# EAGLE design Main (EAGLE 9.1.3)

## Sheet 1 of 3
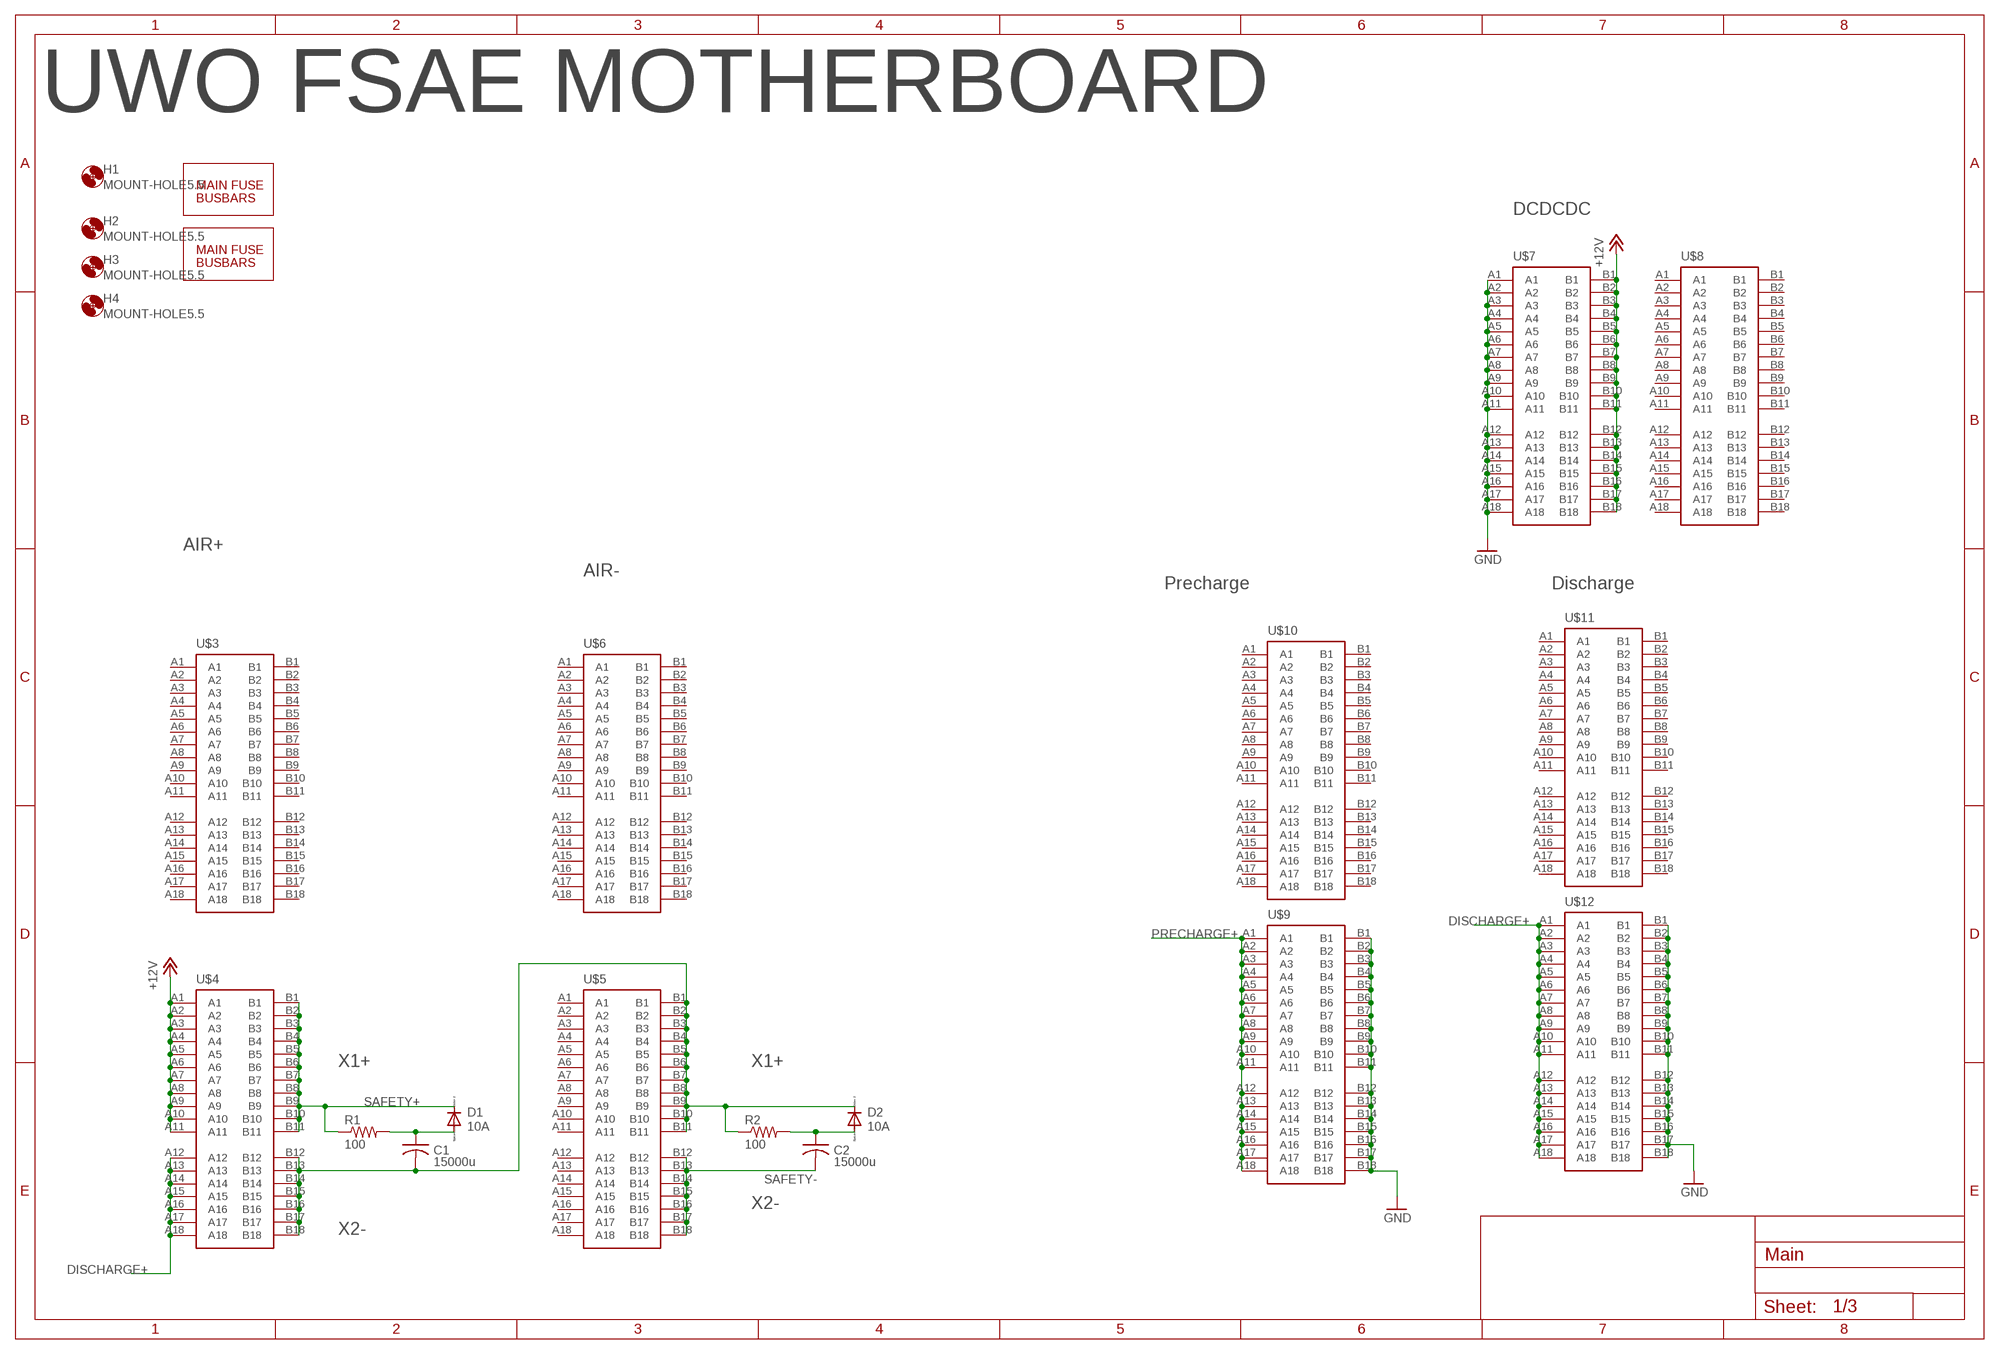
[diagram p0: schematic, sheet 1]

### Parts
C1  15000u  AIR_HOLDUP_CAP  [CAPPRD750W65D1800H3700B]
C2  15000u  AIR_HOLDUP_CAP  [CAPPRD750W65D1800H3700B]
D1  10A  AIR_HOLDUP_DIODE  [DIOAD1570W120L850D500B]
D2  10A  AIR_HOLDUP_DIODE  [DIOAD1570W120L850D500B]
H1  MOUNT-HOLE5.5  [5,5]
H2  MOUNT-HOLE5.5  [5,5]
H3  MOUNT-HOLE5.5  [5,5]
H4  MOUNT-HOLE5.5  [5,5]
R1  100  AIR_HOLDUP_RESISTOR  [RESAD976W63L650D250B]
R2  100  AIR_HOLDUP_RESISTOR  [RESAD976W63L650D250B]
U$1  FUSE_HOLDER  [FUSE_HOLDER]
U$2  FUSE_HOLDER  [FUSE_HOLDER]
U$3  PCIE-36-CONN  [PCI-E-36-CONN]
U$4  PCIE-36-CONN  [PCI-E-36-CONN]
U$5  PCIE-36-CONN  [PCI-E-36-CONN]
U$6  PCIE-36-CONN  [PCI-E-36-CONN]
U$7  PCIE-36-CONN  [PCI-E-36-CONN]
U$8  PCIE-36-CONN  [PCI-E-36-CONN]
U$9  PCIE-36-CONN  [PCI-E-36-CONN]
U$10  PCIE-36-CONN  [PCI-E-36-CONN]
U$11  PCIE-36-CONN  [PCI-E-36-CONN]
U$12  PCIE-36-CONN  [PCI-E-36-CONN]

### Nets
+12V: U$4.A1 U$4.A2 U$4.A3 U$4.A4 U$4.A5 U$4.A6 U$4.A7 U$4.A8 U$4.A9 U$4.A10 U$4.A11 U$7.B1 U$7.B2 U$7.B3 U$7.B4 U$7.B5 U$7.B6 U$7.B7 U$7.B8 U$7.B9 U$7.B10 U$7.B11 U$7.B12 U$7.B13 U$7.B14 U$7.B15 U$7.B16 U$7.B17 U$7.B18 ; also sheet 2,3
DISCHARGE+: U$4.A12 U$4.A13 U$4.A14 U$4.A15 U$4.A16 U$4.A17 U$4.A18 U$12.A1 U$12.A2 U$12.A3 U$12.A4 U$12.A5 U$12.A6 U$12.A7 U$12.A8 U$12.A9 U$12.A10 U$12.A11 U$12.A12 U$12.A13 U$12.A14 U$12.A15 U$12.A16 U$12.A17 U$12.A18
GND: U$7.A1 U$7.A2 U$7.A3 U$7.A4 U$7.A5 U$7.A6 U$7.A7 U$7.A8 U$7.A9 U$7.A10 U$7.A11 U$7.A12 U$7.A13 U$7.A14 U$7.A15 U$7.A16 U$7.A17 U$7.A18 U$9.B1 U$9.B2 U$9.B3 U$9.B4 U$9.B5 U$9.B6 U$9.B7 U$9.B8 U$9.B9 U$9.B10 U$9.B11 U$9.B12 U$9.B13 U$9.B14 U$9.B15 U$9.B16 U$9.B17 U$9.B18 U$12.B1 U$12.B2 U$12.B3 U$12.B4 U$12.B5 U$12.B6 U$12.B7 U$12.B8 U$12.B9 U$12.B10 U$12.B11 U$12.B12 U$12.B13 U$12.B14 U$12.B15 U$12.B16 U$12.B17 U$12.B18 ; also sheet 2,3
N$3: C1.1 D1.2(A) R1.2
N$4: C1.2 D2.1(C) R2.1 U$4.B12 U$4.B13 U$4.B14 U$4.B15 U$4.B16 U$4.B17 U$4.B18 U$5.B1 U$5.B2 U$5.B3 U$5.B4 U$5.B5 U$5.B6 U$5.B7 U$5.B8 U$5.B9 U$5.B10 U$5.B11
N$6: C2.1 D2.2(A) R2.2
PRECHARGE+: U$9.A1 U$9.A2 U$9.A3 U$9.A4 U$9.A5 U$9.A6 U$9.A7 U$9.A8 U$9.A9 U$9.A10 U$9.A11 U$9.A12 U$9.A13 U$9.A14 U$9.A15 U$9.A16 U$9.A17 U$9.A18 ; also sheet 2
SAFETY+: D1.1(C) R1.1 U$4.B1 U$4.B2 U$4.B3 U$4.B4 U$4.B5 U$4.B6 U$4.B7 U$4.B8 U$4.B9 U$4.B10 U$4.B11 ; also sheet 2
SAFETY-: C2.2 U$5.B12 U$5.B13 U$5.B14 U$5.B15 U$5.B16 U$5.B17 U$5.B18 ; also sheet 2
Unconnected: U$3.A1 U$3.A2 U$3.A3 U$3.A4 U$3.A5 U$3.A6 U$3.A7 U$3.A8 U$3.A9 U$3.A10 U$3.A11 U$3.A12 U$3.A13 U$3.A14 U$3.A15 U$3.A16 U$3.A17 U$3.A18 U$3.B1 U$3.B2 U$3.B3 U$3.B4 U$3.B5 U$3.B6 U$3.B7 U$3.B8 U$3.B9 U$3.B10 U$3.B11 U$3.B12 U$3.B13 U$3.B14 U$3.B15 U$3.B16 U$3.B17 U$3.B18 U$5.A1 U$5.A2 U$5.A3 U$5.A4 U$5.A5 U$5.A6 U$5.A7 U$5.A8 U$5.A9 U$5.A10 U$5.A11 U$5.A12 U$5.A13 U$5.A14 U$5.A15 U$5.A16 U$5.A17 U$5.A18 U$6.A1 U$6.A2 U$6.A3 U$6.A4 U$6.A5 U$6.A6 U$6.A7 U$6.A8 U$6.A9 U$6.A10 U$6.A11 U$6.A12 U$6.A13 U$6.A14 U$6.A15 U$6.A16 U$6.A17 U$6.A18 U$6.B1 U$6.B2 U$6.B3 U$6.B4 U$6.B5 U$6.B6 U$6.B7 U$6.B8 U$6.B9 U$6.B10 U$6.B11 U$6.B12 U$6.B13 U$6.B14 U$6.B15 U$6.B16 U$6.B17 U$6.B18 U$8.A1 U$8.A2 U$8.A3 U$8.A4 U$8.A5 U$8.A6 U$8.A7 U$8.A8 U$8.A9 U$8.A10 U$8.A11 U$8.A12 U$8.A13 U$8.A14 U$8.A15 U$8.A16 U$8.A17 U$8.A18 U$8.B1 U$8.B2 U$8.B3 U$8.B4 U$8.B5 U$8.B6 U$8.B7 U$8.B8 U$8.B9 U$8.B10 U$8.B11 U$8.B12 U$8.B13 U$8.B14 U$8.B15 U$8.B16 U$8.B17 U$8.B18 U$10.A1 U$10.A2 U$10.A3 U$10.A4 U$10.A5 U$10.A6 U$10.A7 U$10.A8 U$10.A9 U$10.A10 U$10.A11 U$10.A12 U$10.A13 U$10.A14 U$10.A15 U$10.A16 U$10.A17 U$10.A18 U$10.B1 U$10.B2 U$10.B3 U$10.B4 U$10.B5 U$10.B6 U$10.B7 U$10.B8 U$10.B9 U$10.B10 U$10.B11 U$10.B12 U$10.B13 U$10.B14 U$10.B15 U$10.B16 U$10.B17 U$10.B18 U$11.A1 U$11.A2 U$11.A3 U$11.A4 U$11.A5 U$11.A6 U$11.A7 U$11.A8 U$11.A9 U$11.A10 U$11.A11 U$11.A12 U$11.A13 U$11.A14 U$11.A15 U$11.A16 U$11.A17 U$11.A18 U$11.B1 U$11.B2 U$11.B3 U$11.B4 U$11.B5 U$11.B6 U$11.B7 U$11.B8 U$11.B9 U$11.B10 U$11.B11 U$11.B12 U$11.B13 U$11.B14 U$11.B15 U$11.B16 U$11.B17 U$11.B18

### Notes on the sheet
- UWO FSAE MOTHERBOARD
- DCDCDC
- AIR+
- AIR-
- Precharge | Discharge
- X1+ | X1+
- X2-
- X2-

## Sheet 2 of 3
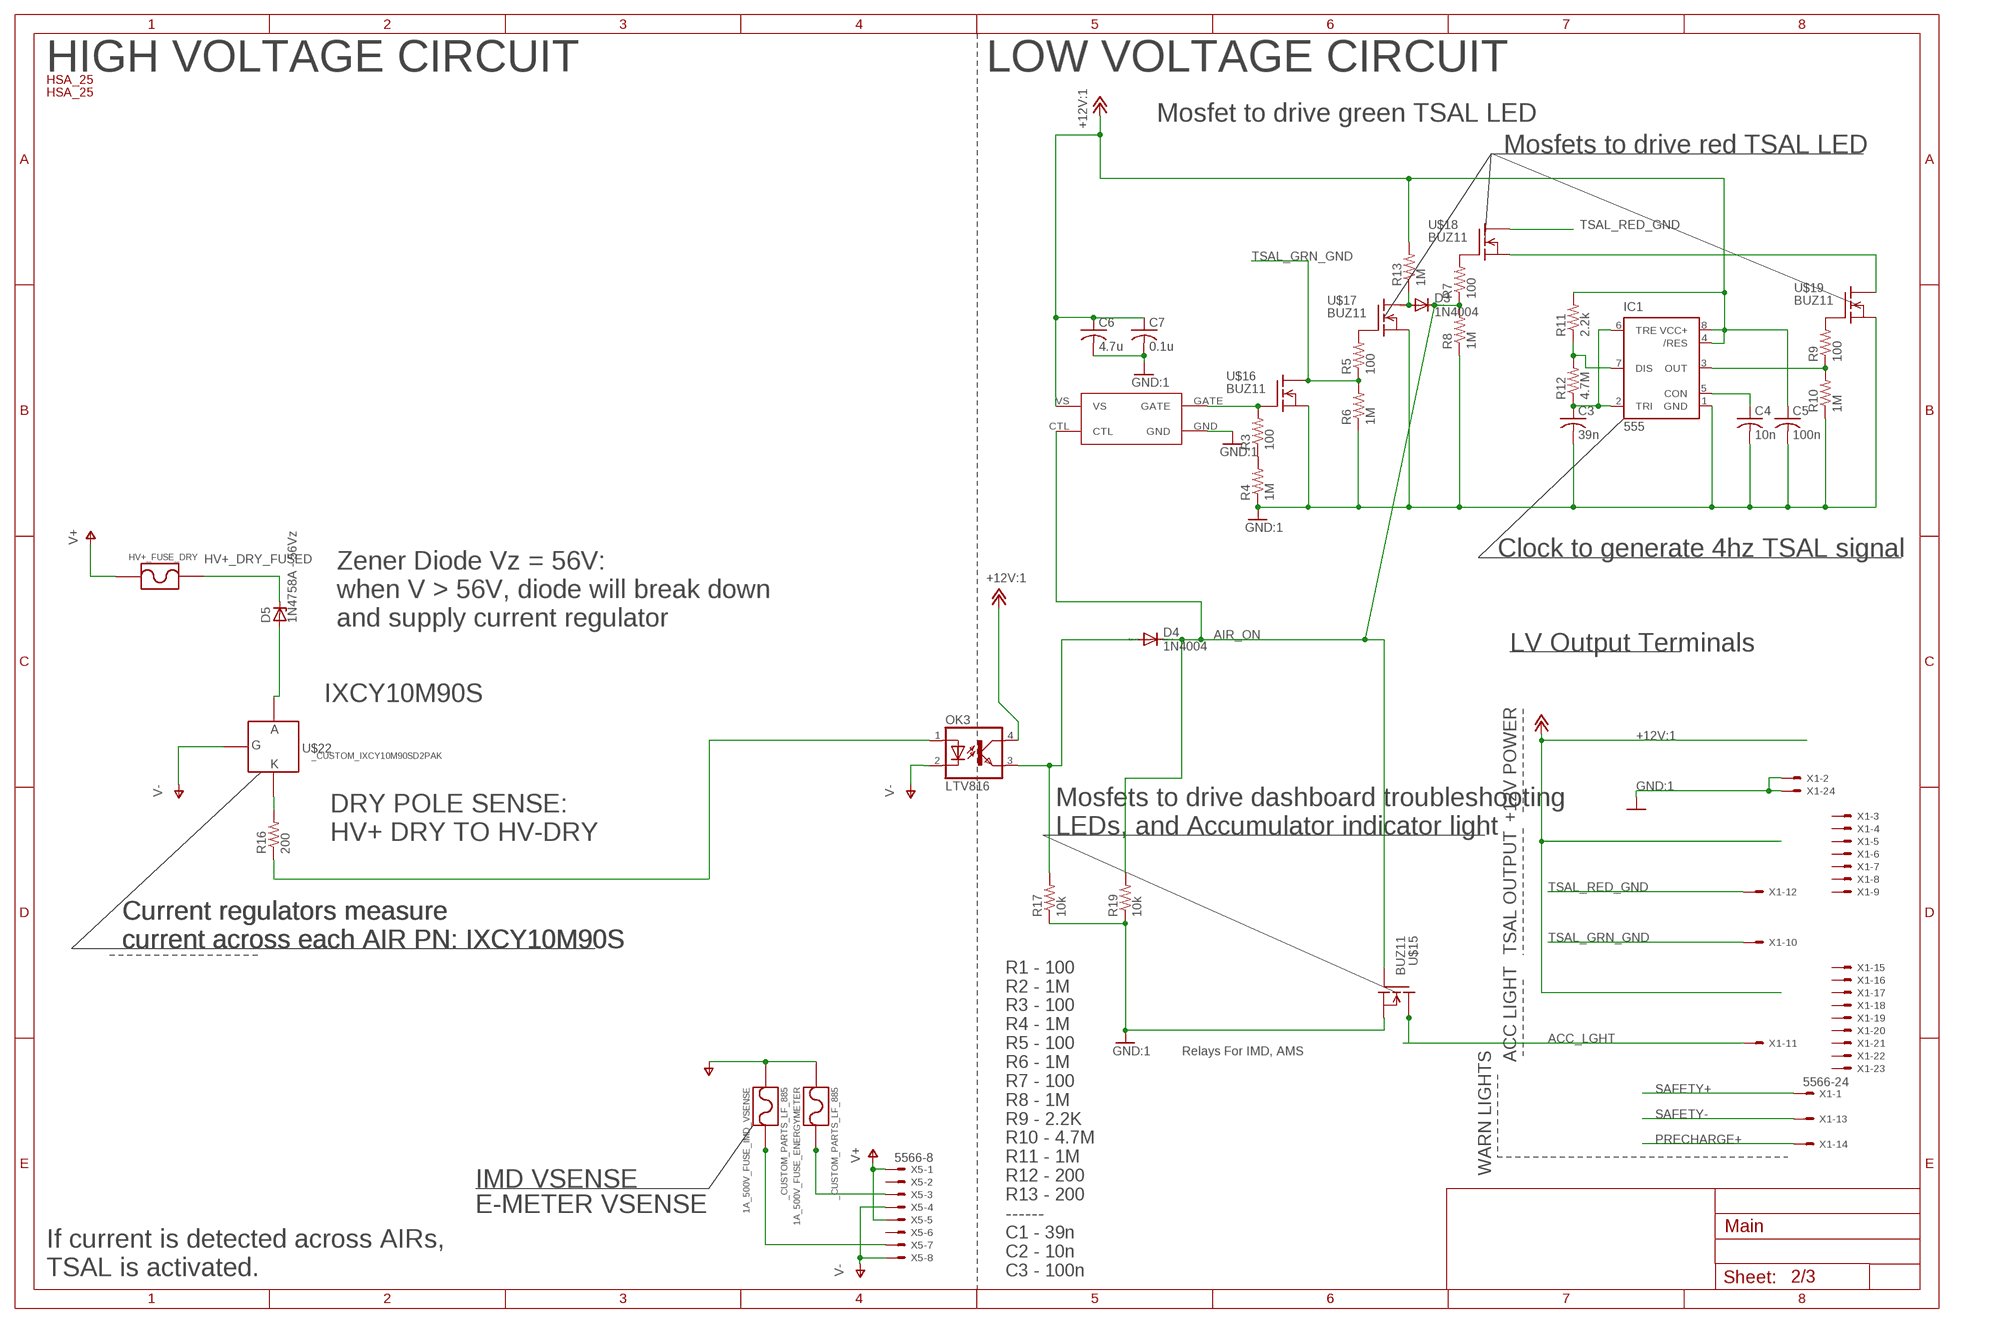
[diagram p1: schematic, sheet 2]

### Parts
1A_500V_FUSE_ENERGYMETER  _CUSTOM_PARTS_LF_885  [_CUSTOM_PARTS_LF_885]
1A_500V_FUSE_IMD_VSENSE  _CUSTOM_PARTS_LF_885  [_CUSTOM_PARTS_LF_885]
C3  39n  C-USC0805  [C0805]
C4  10n  C-USC0805  [C0805]
C5  100n  C-USC0805  [C0805]
C6  4.7u  C-USC0805  [C0805]
C7  0.1u  C-USC0805  [C0805]
D3  1N4004  [DO41-10]
D4  1N4004  [DO41-10]
D5  1N4758A - 56Vz  ZENER-DIODEZD-12.5  [ZDIO12.5]
HV+_FUSE_DRY  _CUSTOM_PARTS_LF_885  [_CUSTOM_PARTS_LF_885]
IC1  555  555P  [DIP08]
OK3  LTV816  [DIL04]
R3  100  R-US_R0805:1  [R0805:1]
R4  1M  R-US_R0805:1  [R0805:1]
R5  100  R-US_R0805:1  [R0805:1]
R6  1M  R-US_R0805:1  [R0805:1]
R7  100  R-US_R0805:1  [R0805:1]
R8  1M  R-US_R0805:1  [R0805:1]
R9  100  R-US_R0805:1  [R0805:1]
R10  1M  R-US_R0805:1  [R0805:1]
R11  2.2k  R-US_R0805:1  [R0805:1]
R12  4.7M  R-US_R0805:1  [R0805:1]
R13  1M  R-US_R0805:1  [R0805:1]
R16  200  R-US_R2010  [R2010]
R17  10k  R-US_R0805:1  [R0805:1]
R19  10k  R-US_R0805:1  [R0805:1]
U$15  BUZ11  [TO220]
U$16  BUZ11  [TO220]
U$17  BUZ11  [TO220]
U$18  BUZ11  [TO220]
U$19  BUZ11  [TO220]
U$22  _CUSTOM_IXCY10M90SD2PAK  [TO228P991X238-3]
U$23  MIC4417  [PDM_2019_REVB_MIC4416YM4-TR]
U$24  HSA25  [HSA_25_FOOT]
U$25  HSA25  [HSA_25_FOOT]
X1  5566-24  [5566-24]
X5  5566-8  [5566-8]

### Nets
+12V: C5.1 C6.1 C7.1 IC1.4(/RES) IC1.8(VCC+) OK3.4(COL) R11.2 R13.2 U$23.VS ; supply symbol labelled +12V:1 ; also sheet 1,3
ACC_LGHT: U$15.2(D) X1.11
AIR_ON: D3.C D4.C R7.1 R8.2 R19.2 U$15.1(G) U$23.CTL
GND: C3.2 C4.2 C5.2 C6.2 C7.2 IC1.1(GND) R4.1 R6.1 R8.1 R10.1 R17.1 R19.1 U$15.3(S) U$16.3(S) U$17.3(S) U$19.3(S) U$23.GND X1.2 X1.24 ; supply symbol labelled GND:1 ; also sheet 1,3
HV+_DRY_FUSED [LV]: D5.C HV+_FUSE_DRY.P$1
N$1: C4.1 IC1.5(CON)
N$2: 1A_500V_FUSE_ENERGYMETER.P$2 X5.3
N$7: IC1.7(DIS) R11.1 R12.2
N$8: IC1.3(OUT) R9.1 R10.2
N$9: C3.1 IC1.2(TRI) IC1.6(TRE) R12.1
N$10: R3.1 R4.2
N$11: R3.2 U$16.1(G) U$23.GATE
N$12: R5.2 U$17.1(G)
N$13: U$18.3(S) U$19.2(D)
N$14: D4.A OK3.3(EMIT) R17.2
N$15: D3.A R13.1 U$17.2(D)
N$16: R7.2 U$18.1(G)
N$17: R9.2 U$19.1(G)
N$18: 1A_500V_FUSE_IMD_VSENSE.P$2 X5.7
N$20: R16.2 U$22.2(K)
N$21: D5.A U$22.3(A)
N$22: OK3.1(A) R16.1
PRECHARGE+: X1.14 ; also sheet 1
SAFETY+: X1.1 ; also sheet 1
SAFETY-: X1.13 ; also sheet 1
TSAL_GRN_GND: R5.1 R6.2 U$16.2(D) X1.10
TSAL_RED_GND: U$18.2(D) X1.12
V+ [LV]: HV+_FUSE_DRY.P$2 X5.1 X5.5
V- [LV]: 1A_500V_FUSE_ENERGYMETER.P$1 1A_500V_FUSE_IMD_VSENSE.P$1 OK3.2(C) U$22.1(G) X5.4 X5.8
Unconnected: X1.3 X1.4 X1.5 X1.6 X1.7 X1.8 X1.9 X1.15 X1.16 X1.17 X1.18 X1.19 X1.20 X1.21 X1.22 X1.23 X5.2 X5.6

### Notes on the sheet
- HIGH VOLTAGE CIRCUIT | LOW VOLTAGE CIRCUIT
- Mosfet to drive green TSAL LED
- Mosfets to drive red TSAL LED
- Clock to generate 4hz TSAL signal
- Zener Diode Vz = 56V: 
  when V > 56V, diode will break down 
  and supply current regulator
- LV Output Terminals
- IXCY10M90S
- +12V POWER
- Mosfets to drive dashboard troubleshooting
  LEDs, and Accumulator indicator light
- DRY POLE SENSE:
  HV+ DRY TO HV-DRY
- Current regulators measure 
  current across each AIR PN: IXCY10M90S
- Current regulators measure 
  current across each AIR PN: IXCY10M90S
- Current regulators measure 
  current across each AIR PN: IXCY10M90S
- TSAL OUTPUT
- Relays For IMD, AMS
- ACC LIGHT
- WARN LIGHTS
- IMD VSENSE
- E-METER VSENSE
- If current is detected across AIRs, 
  TSAL is activated.
- R1 - 100
  R2 - 1M
  R3 - 100
  R4 - 1M
  R5 - 100
  R6 - 1M
  R7 - 100
  R8 - 1M
  R9 - 2.2K
  R10 - 4.7M
  R11 - 1M
  R12 - 200
  R13 - 200
  ------
  C1 - 39n
  C2 - 10n
  C3 - 100n

## Sheet 3 of 3
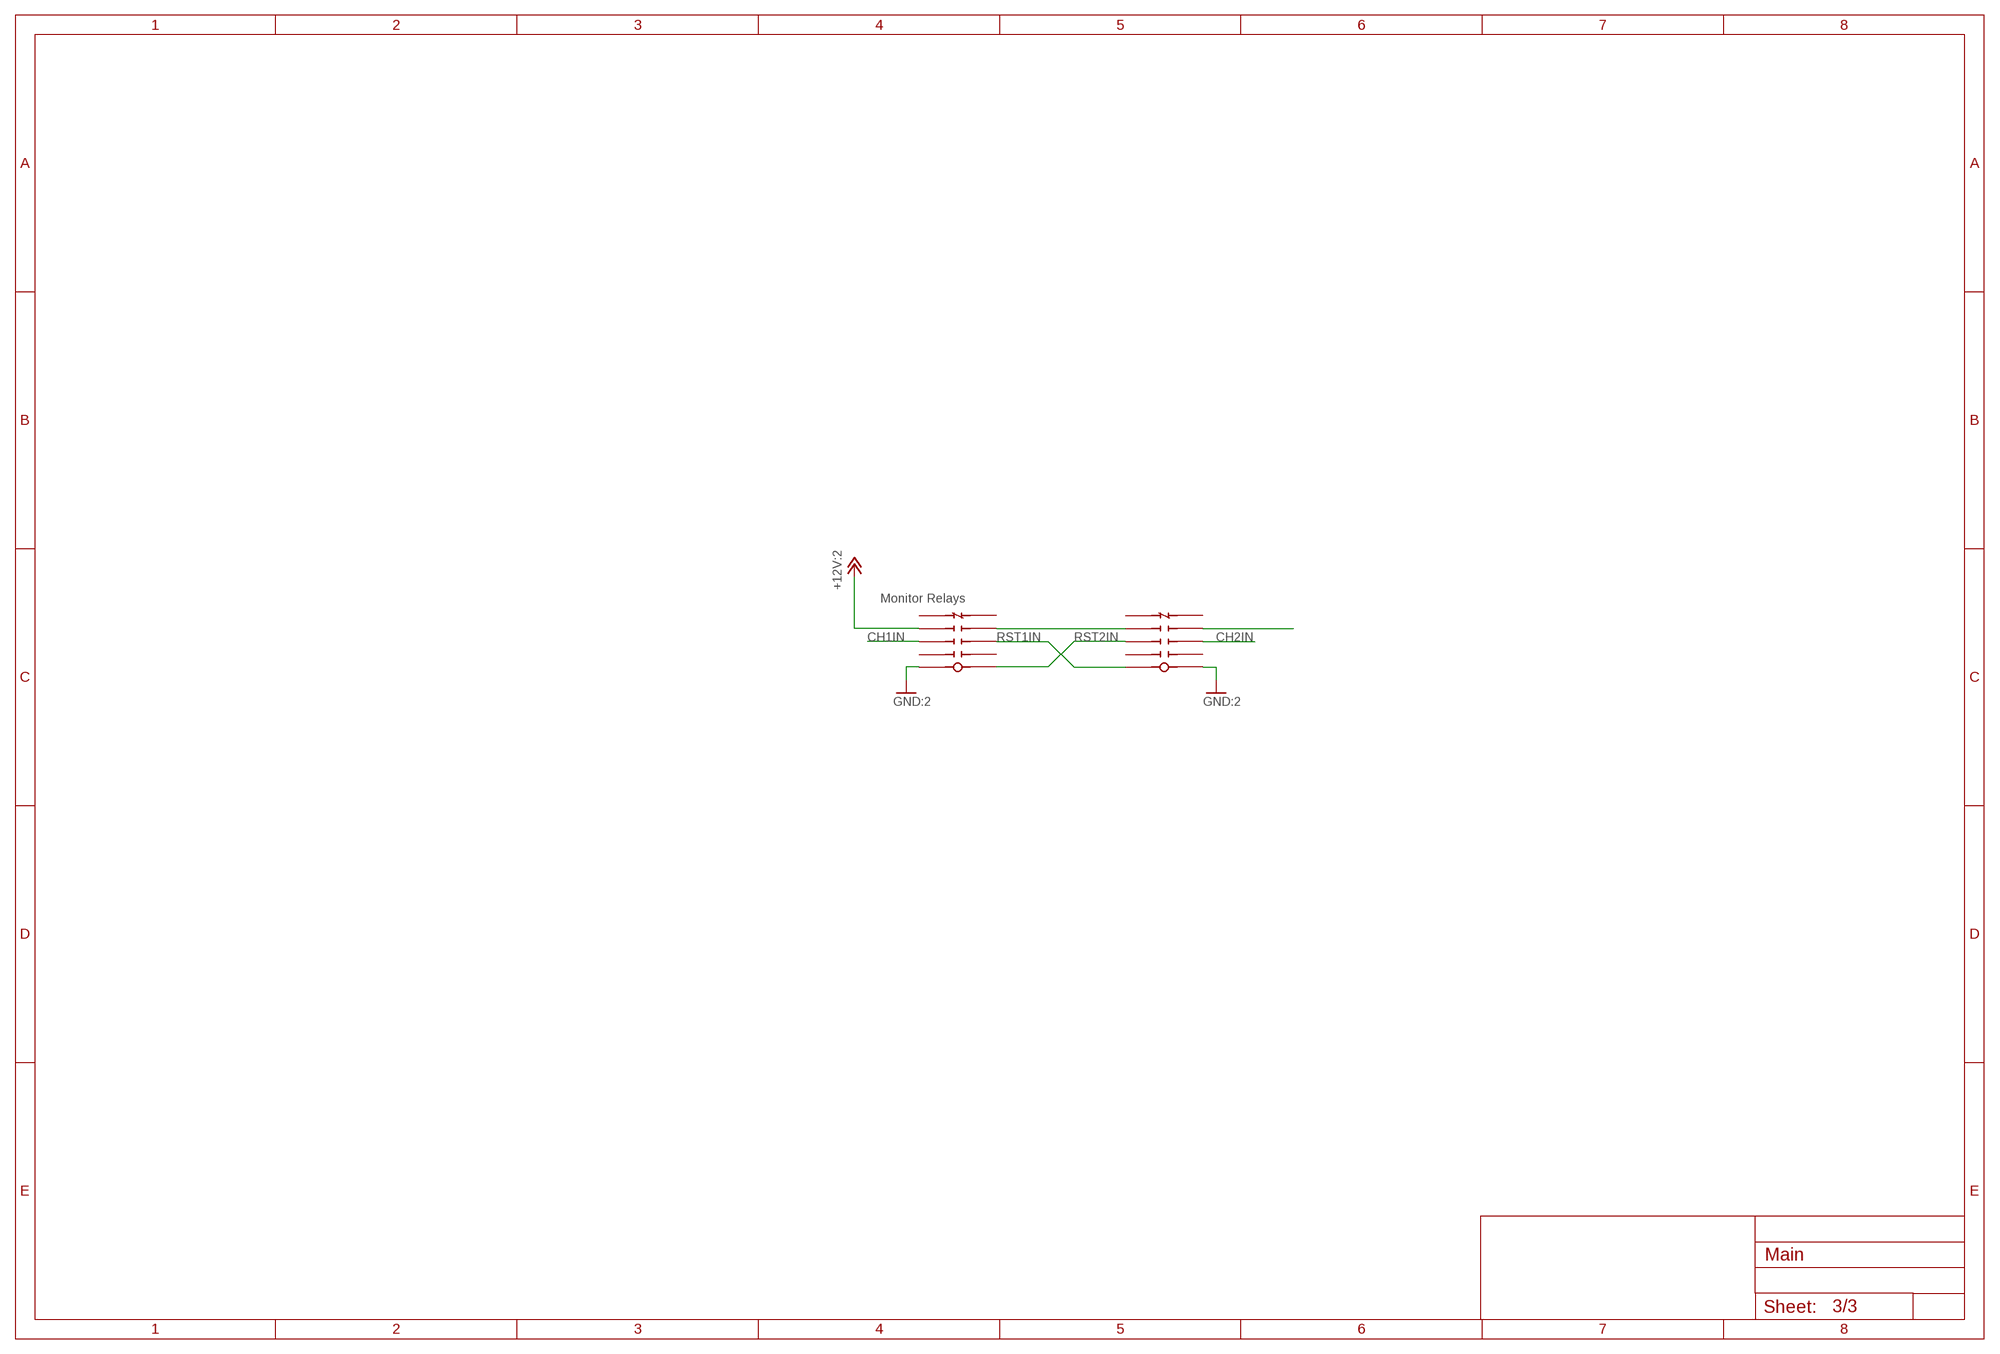
[diagram p2: schematic, sheet 3]

### Parts
U$13  SR4M4012_TE  [SR4M4012_FOOT]
U$14  SR4M4012_TE  [SR4M4012_FOOT]

### Nets
+12V: U$13.NOA3 ; supply symbol labelled +12V:2 ; also sheet 1,2
CH1IN: U$13.NOA2
CH2IN: U$14.NOB2
GND: U$13.COIL+ U$14.COIL- ; supply symbol labelled GND:2 ; also sheet 1,2
N$5: U$13.NOB3 U$14.NOA3
N$19: U$14.NOB3
RST1IN: U$13.NOB2 U$14.COIL+
RST2IN: U$13.COIL- U$14.NOA2
Unconnected: U$13.NCA4 U$13.NCB4 U$13.NOA1 U$13.NOB1 U$14.NCA4 U$14.NCB4 U$14.NOA1 U$14.NOB1

### Notes on the sheet
- Monitor Relays

## Library data of the parts
1A_500V_FUSE_ENERGYMETER 1A_500V_FUSE_IMD_VSENSE HV+_FUSE_DRY = Main:_CUSTOM_PARTS_LF_885
C1 C2 = Main:AIR_HOLDUP_CAP
C3-C7 = Main:C-US: CAPACITOR, American symbol
D1 D2 = Main:AIR_HOLDUP_DIODE
D3 D4 = Main:1N4004: DIODE general purpose rectifier, 1 A
D5 = Main:ZENER-DIODE: Z-Diode
H1-H4 = Main:MOUNT-HOLE: MOUNTING HOLE with drill center marker
IC1 = Main:555: General purpose bipolar Timer Datasheet SparkFun Products SparkFun SparkPunk Sequencer Kit (KIT-12707) Storefront Component: 555 Timer (COM-09273) Two parts valid for production: VFP: IC-11930 (M7555 PTH) VFP: IC-09173 (555 PTH) - Preferred; PROD_ID: IC-09173; PROD_ID_ALT: IC-09173
OK3 = Main:LTV816: OPTO COUPLER Source: LITEON, LTV816.pdf; OC_FARNELL: unknown; OC_NEWARK: unknown
R1 R2 = Main:AIR_HOLDUP_RESISTOR
R3-R13 R17 R19 = ACC-MB-R0:R-US_*?:1: RESISTOR, American symbol
R16 = Main:R-US_: RESISTOR, American symbol; SPICEPREFIX: R
U$1 U$2 = Main:FUSE_HOLDER
U$3-U$12 = Main:PCIE-36-CONN
U$13 U$14 = Main:SR4M4012_TE
U$15-U$19 = Main:BUZ11: N-Channel Enhancement MOSFET 50V; 30A; 0,040Ohm
U$22 = Main:_CUSTOM_IXCY10M90S
U$23 = Main:MIC4417; MPN: MIC4417
U$24 U$25 = Main:HSA25
X1 = Main:5566-24: Mini FIT connector 24 pol Source: http://www.molex.com; MF: MOLEX; OC_FARNELL: unknown; OC_NEWARK: unknown
X5 = Main:5566-8: Mini FIT connector 8 pol Source: http://www.molex.com; MF: MOLEX; OC_FARNELL: unknown; OC_NEWARK: unknown

## Net classes
0 default: width 1 mm, clearance 0.152 mm
1 LV: clearance 0.001 mm

## Board
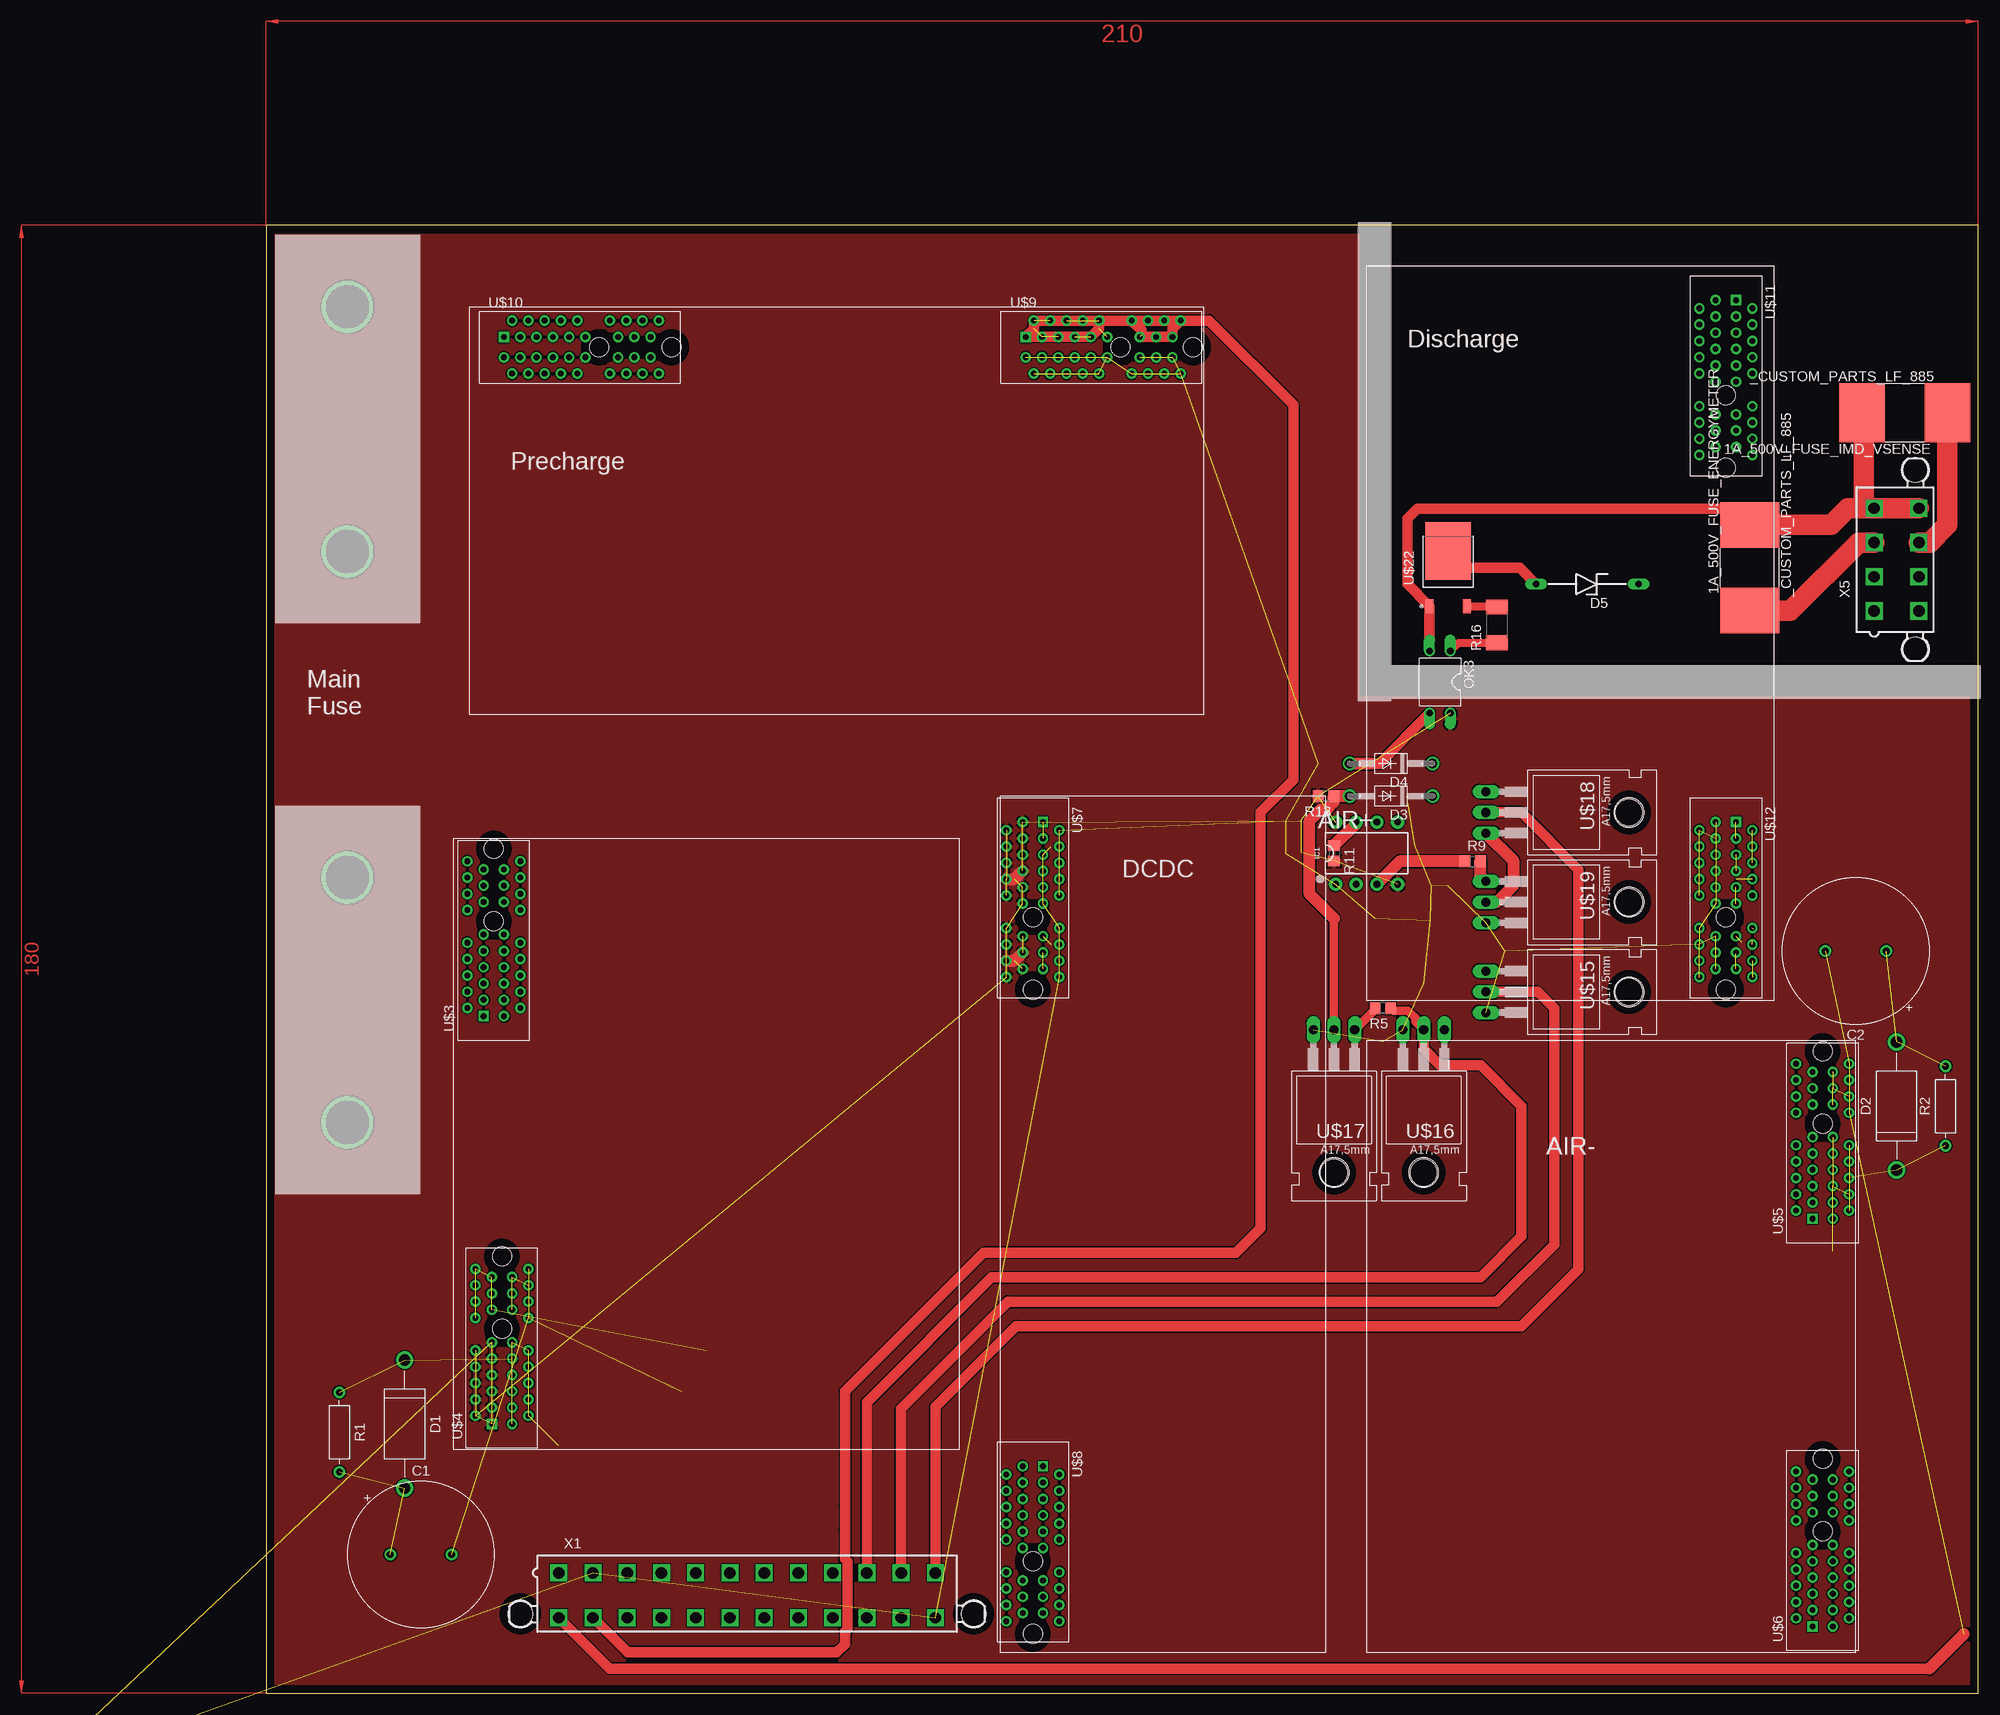
[diagram p3: board, top side]
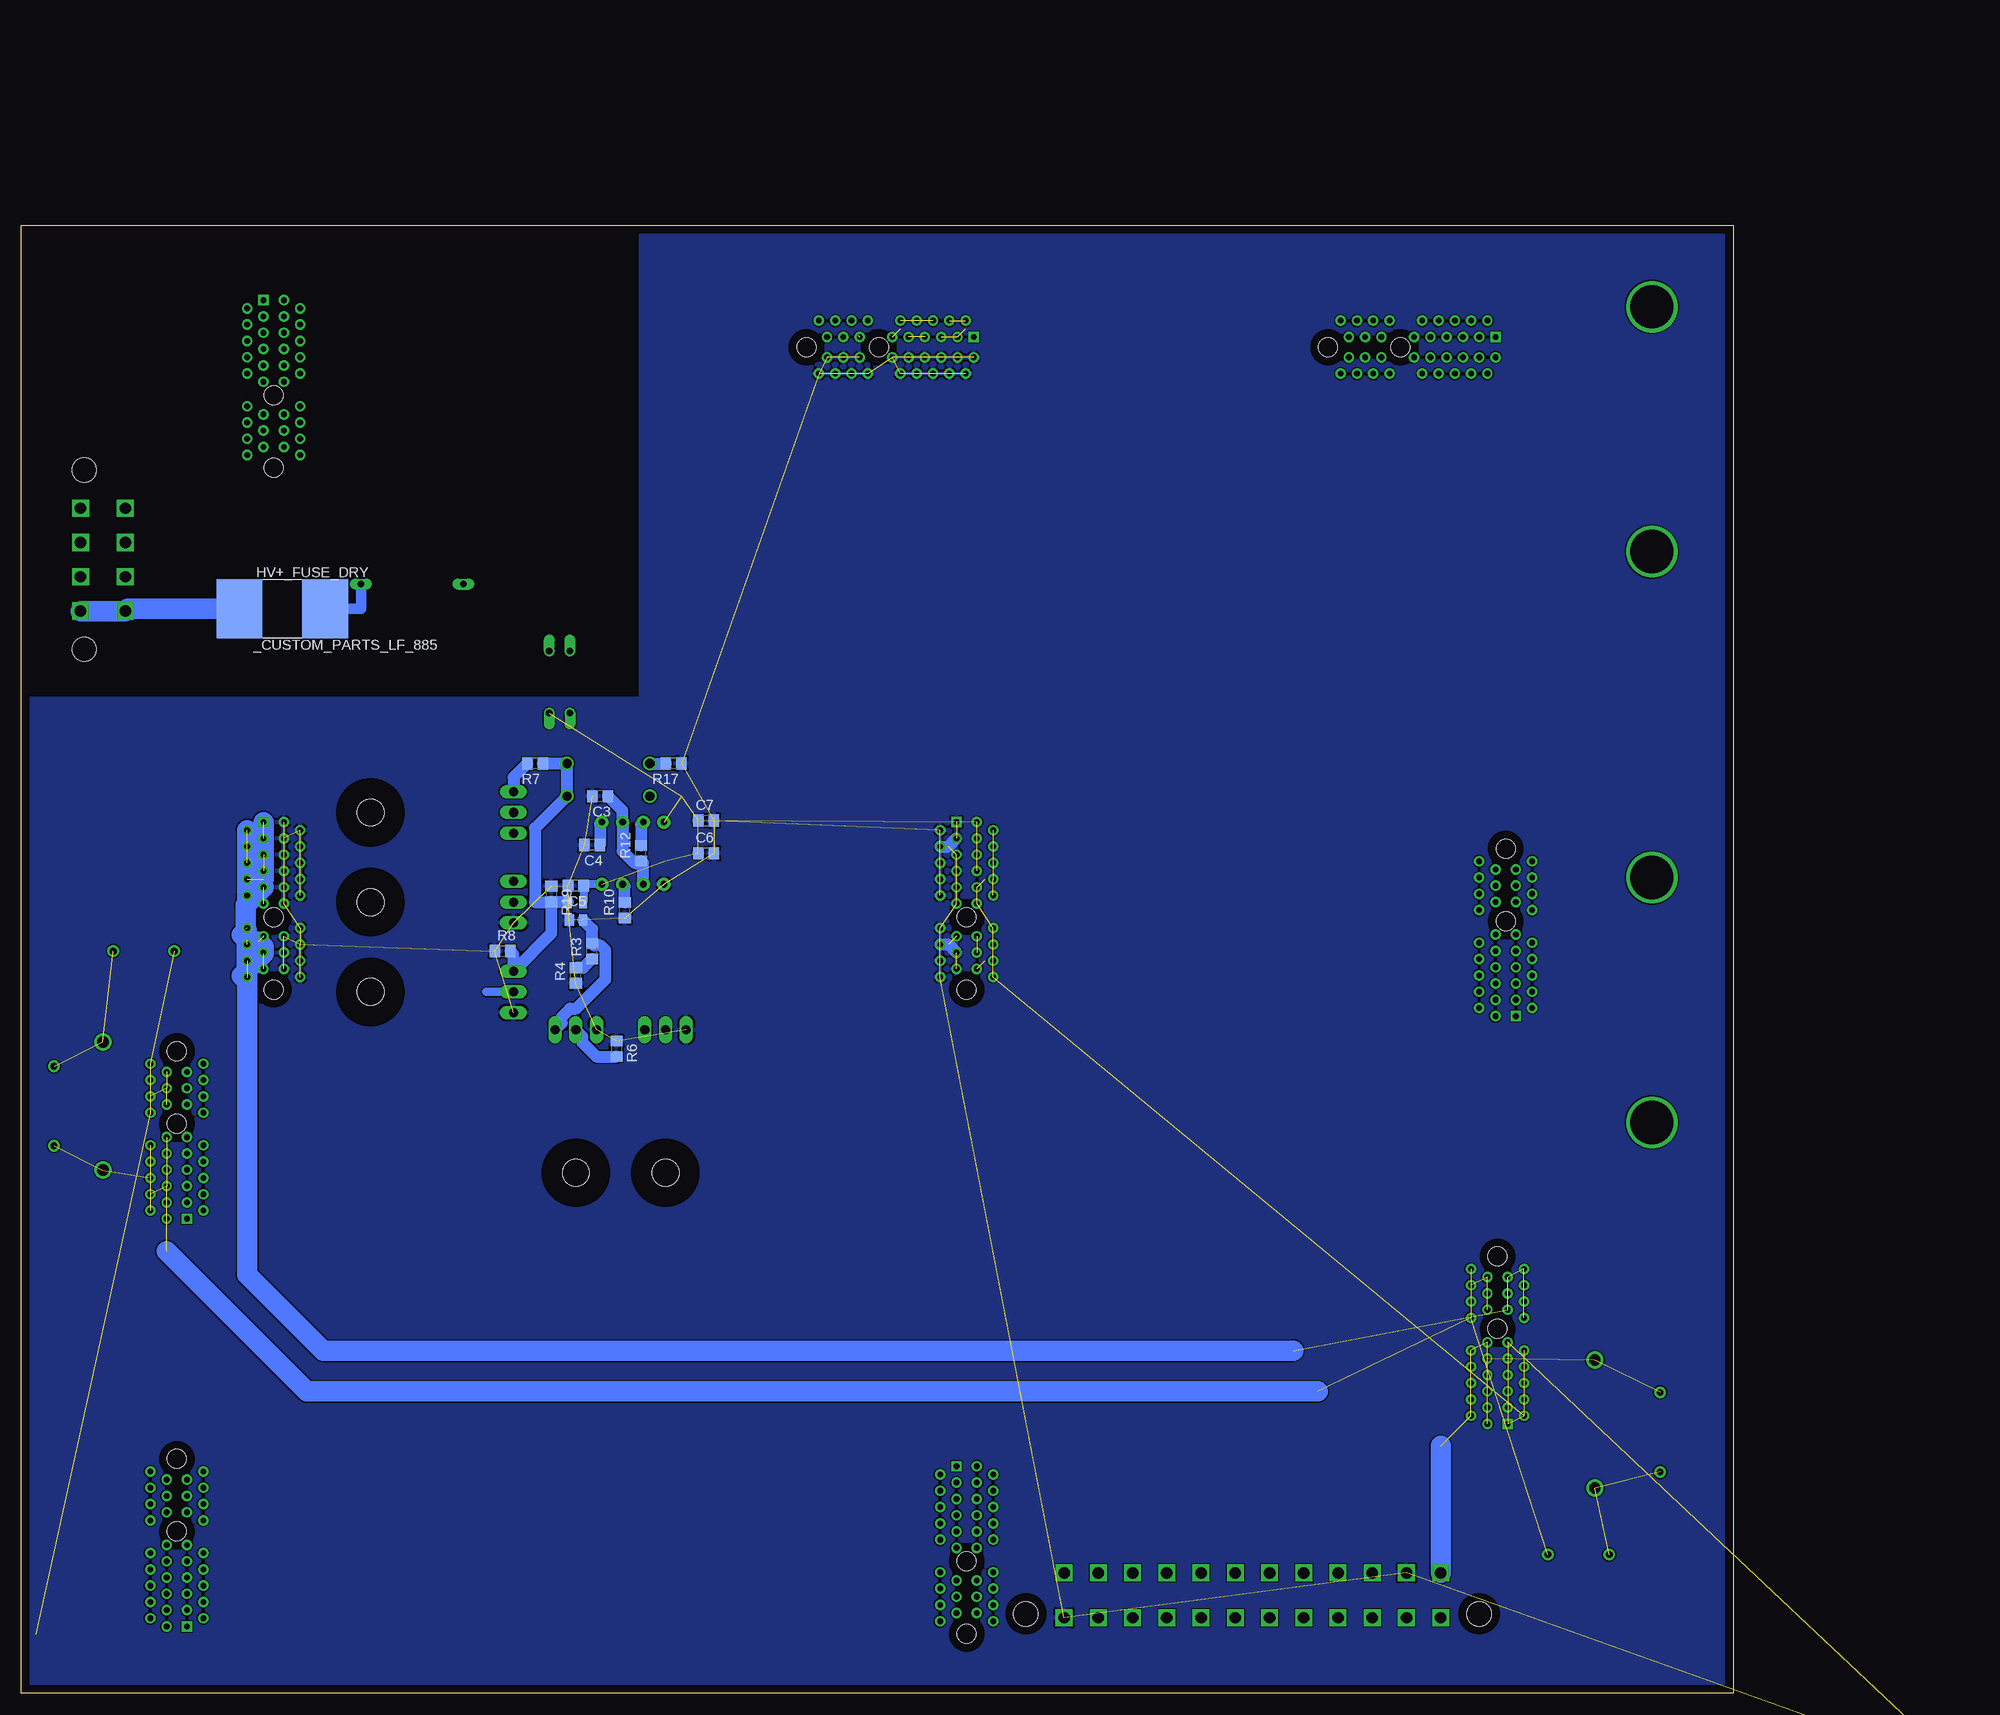
[diagram p4: board, bottom side, seen from below]

Size 210 x 180 mm. Coordinates in mm from the lower left corner, seen from the top.
Outline: 0,0 210,0 210,180 0,180 0,0
Copper layers (1*16): Top 0.035mm / dielectric 1.5mm / Bottom 0.035mm
Design rules "default": minimum track width 6mil, minimum drill 0.35mm, track to track 6mil, track to pad 6mil, pad to pad 6mil, via to via 6mil, smd to smd 6mil, copper to edge 40mil, drill to drill 6mil, minimum pad ring 10mil, minimum via ring 8mil, stop-mask expansion 4mil, vias tented up to drill 0mil, thermal gap 10mil

### Footprints (pad centres in the part's own frame; a part is rotated, then mirrored left to right if it is on the bottom)
_CUSTOM_PARTS_LF_885 = smd 5.6 x 7.23: P$1 5.25,0; P$2 -5.25,0
CAPPRD750W65D1800H3700B = drill 0.85 pad 1.45: 1 -3.75,0; 2 3.75,0
C0805 = smd 1.3 x 1.5: 1 -0.95,0; 2 0.95,0
DIOAD1570W120L850D500B = drill 1.4 pad 2.1: 1 -7.85,0; 2 7.85,0
DO41-10 = drill 1.118: A 5.08,0; C -5.08,0
ZDIO12.5 = drill 0.813 long: A 6.223,0; C -6.35,0
5,5 = hole 5.5: 0,0
DIP08 = drill 0.813 pad 1.626: 1 -3.81,-3.81; 2 -1.27,-3.81; 3 1.27,-3.81; 4 3.81,-3.81; 5 3.81,3.81; 6 1.27,3.81; 7 -1.27,3.81; 8 -3.81,3.81
DIL04 = drill 0.813 offset: 1 -1.27,-3.81; 2 1.27,-3.81; 3 1.27,3.81; 4 -1.27,3.81
RESAD976W63L650D250B = drill 0.83 pad 1.43: 1 -4.88,0; 2 4.88,0
R0805:1 = smd 1.3 x 1.5: 1 -0.95,0; 2 0.95,0
R2010 = smd 1.8 x 2.7: 1 -2.2,0; 2 2.2,0
FUSE_HOLDER = drill 5.3: P$1 -15.01,0; P$2 15.01,0
PCI-E-36-CONN = drill 0.7 pad 1.27 square: A1 3.18,5.31 | drill 0.7 pad 1.27: A2 4.18,7.31; A3 5.18,5.31; A4 6.18,7.31; A5 7.18,5.31; A6 8.18,7.31; A7 9.18,5.31; A8 10.18,7.31; A9 11.18,5.31; A10 12.18,7.31; A11 13.18,5.31; A12 16.18,7.31; A13 17.18,5.31; A14 18.18,7.31; A15 19.18,5.31; A16 20.18,7.31; A17 21.18,5.31; A18 22.18,7.31; B1 3.18,2.81; B2 4.18,0.81; B3 5.18,2.81; B4 6.18,0.81; B5 7.18,2.81; B6 8.18,0.81; B7 9.18,2.81; B8 10.18,0.81; B9 11.18,2.81; B10 12.18,0.81; B11 13.18,2.81; B12 16.18,0.81; B13 17.18,2.81; B14 18.18,0.81; B15 19.18,2.81; B16 20.18,0.81; B17 21.18,2.81; B18 22.18,0.81 | hole 2.35: 14.83,4.06; 23.72,4.06
SR4M4012_FOOT = drill 1.3 pad 2 square: COIL+ 0,7.6; COIL- 0,0; NCA4 18.05,0; NCB4 23.05,0; NOA1 18.05,7.6; NOA2 29.55,7.6; NOA3 29.55,0; NOB1 23.05,7.6; NOB2 34.55,7.6; NOB3 34.55,0
TO220 = drill 1.118 long: 1 -2.54,-6.35; 2 0,-6.35; 3 2.54,-6.35 | hole 3.302: 0,11.176
TO228P991X238-3 = smd 1.718 x 0.974: 1 -4.704,2.28; 2 -4.704,-2.28 | smd 7.001 x 5.544: 3 2.063,0
PDM_2019_REVB_MIC4416YM4-TR = smd 1 x 1.44: CTL 0,0; GATE 1.9,-2.2; VS 1.9,0 | smd 1.2 x 1.44: GND 0.2,-2.2
HSA_25_FOOT = hole 3.3: 34.65,23.9; 16.35,4.1
5566-24 = drill 1.4 square: 1 23.1,-2.75; 2 18.9,-2.75; 3 14.7,-2.75; 4 10.5,-2.75; 5 6.3,-2.75; 6 2.1,-2.75; 7 -2.1,-2.75; 8 -6.3,-2.75; 9 -10.5,-2.75; 10 -14.7,-2.75; 11 -18.9,-2.75; 12 -23.1,-2.75; 13 23.1,2.75; 14 18.9,2.75; 15 14.7,2.75; 16 10.5,2.75; 17 6.3,2.75; 18 2.1,2.75; 19 -2.1,2.75; 20 -6.3,2.75; 21 -10.5,2.75; 22 -14.7,2.75; 23 -18.9,2.75; 24 -23.1,2.75 | hole 3: 27.8,2.29; -27.8,2.29
5566-8 = drill 1.4 square: 1 6.3,-2.75; 2 2.1,-2.75; 3 -2.1,-2.75; 4 -6.3,-2.75; 5 6.3,2.75; 6 2.1,2.75; 7 -2.1,2.75; 8 -6.3,2.75 | hole 3: 11,2.29; -11,2.29

### Placement (x,y rotation side)
1A_500V_FUSE_ENERGYMETER  182,138 90 top
1A_500V_FUSE_IMD_VSENSE  201,157 180 top
C1  19,17 0 top
C2  195,91 180 top
C3  139,110 180 bottom
C4  140,104 180 bottom
C5  142,99 180 bottom
C6  126,103 0 bottom
C7  126,107 0 bottom
D1  17,33 270 top
D2  200,72 90 top
D3  138,110 180 top
D4  138,114 180 top
D5  162,136 180 top
H1  not placed on the board
H2  not placed on the board
H3  not placed on the board
H4  not placed on the board
HV+_FUSE_DRY  178,133 0 bottom
IC1  135,103 0 top
OK3  144,124 180 top
R1  9,32 270 top
R2  206,72 90 top
R3  140,91 90 bottom
R4  142,88 90 bottom
R5  137,84 180 top
R6  137,79 270 bottom
R7  147,114 180 bottom
R8  151,91 0 bottom
R9  148,102 0 top
R10  136,96 90 bottom
R11  131,103 270 top
R12  134,103 90 bottom
R13  130,110 180 top
R16  151,131 90 top
R17  130,114 180 bottom
R19  145,98 270 bottom
U$1  10,155 90 top
U$2  10,85 90 top
U$3  32,79.84 90 top
U$4  33,29.84 90 top
U$5  195,55 90 top
U$6  195,5 90 top
U$7  90,110 270 top
U$8  90,31 270 top
U$9  90,161 0 top
U$10  26,161 0 top
U$11  175,174 270 top
U$12  175,110 270 top
U$13  not placed on the board
U$14  not placed on the board
U$15  156,86 270 top
U$16  142,75 180 top
U$17  131,75 180 top
U$18  156,108 270 top
U$19  156,97 270 top
U$22  145,138 90 top
U$23  143,97 0 bottom
U$24  not placed on the board
U$25  not placed on the board
X1  59,12 180 top
X5  200,139 270 top

### Tracks (layer width: path | path; a pad name or v marks a point on that pad's centre or on a via)
+12V  (34 unrouted)
  Top 1.5: U$7.B16 91.81,89.82 U$7.B15 | U$7.B8 91.81,99.82 U$7.B7
  Bottom 1: IC1.4 140.86,99.19 C5.1 141.05,97.05 U$23.VS
  Bottom 1.5: C7.1 127,106.95 | 127,103.05 C6.1
  pour Top: -1,181 -1,0 211,0 211,122 134,122 134,182 -1,182
ACC_LGHT
  Top 1.27: X1.11 77.9,34.9 91,48 151,48 158,55 158,84 156,86 U$15.2
  Bottom 1.016: 153,86 U$15.2
AIR_ON
  Bottom 1.5: U$23.CTL 144.95,97 R19.2 | R19.2 145,93.19 U$15.1 149.65,90.6 R8.2 | R19.2 145.05,97 147,97 147,106.08 D3.C D4.C R7.1
DISCHARGE+  (19 unrouted)
  Bottom 2.54: U$12.A2 U$12.A10 | U$12.A10 182.31,96.81 | 182.31,96.81 182.52,96.6 182.52,93.74 182.46,93.67 | 182.46,93.67 182.46,93.54 183,93 182.31,92.31 182.31,87.92 182.36,87.87 | 182.36,87.87 182.87,87.87 183,88 180.31,90.69 180.96,91.34 180.96,92.17 180.31,91.53 U$12.A15 | U$12.A10 180.31,99.82 U$12.A7 U$12.A1 | U$12.A9 182.31,96.81 | 182.46,93.67 182.36,93.58 182.36,87.87 | U$12.A18 182.31,51.31 173,42 54,42
GND  (72 unrouted)
  Bottom 1.5: U$7.A4 96.31,103.82 U$7.A3 | U$7.A14 96.31,91.82 U$7.A15
  pour Bottom: -2,183 -2,-1 212,-1 212,122 134,122 134,183
HV+_DRY_FUSED
  Bottom 1.27: HV+_FUSE_DRY.P$1 168.35,133 D5.C
N$1
  Bottom 1.5: IC1.5 139.05,106.57 C4.1
N$2
  Top 2.54: 1A_500V_FUSE_ENERGYMETER.P$2 187,132.75 195.35,141.1 X5.3
N$3  (2 unrouted)
N$4  (21 unrouted)
  Bottom 2.54: 192.19,54.19 175,37 51,37
N$5  (1 unrouted)
N$6  (2 unrouted)
N$7
  Top 1.5: R11.1 133.73,106.68 IC1.7
  Bottom 1.5: IC1.7 134,106.54 R12.2
N$8
  Top 1.5: R9.1 139.08,102 IC1.3
  Bottom 1.5: R10.2 136,98.92 IC1.3
N$9
  Bottom 1.5: IC1.2 133.73,101.78 | 133.73,101.78 R12.1 | 133.73,101.78 134.78,101.78 136.27,103.27 IC1.6 136.27,108.22 C3.1
N$10
  Bottom 1.5: R3.1 141.1,88.95 R4.2
N$11
  Bottom 1.5: U$16.1 143.74,82.15 143.74,82.91 142.72,83.93 141.96,83.93 138.35,87.54 138.35,91.07 138.98,91.7 139.75,91.7 R3.2 140,93.7 U$23.GATE
N$12
  Top 1.016: U$17.1 136.05,83.86 R5.2
N$13
  Top 1.5: U$18.3 153,102.11 153,99 151,97 U$19.2
N$14
  Top 1.27: D4.A 136.54,114 OK3.3
  Top 1.5: 135.54,114 D4.A
  Bottom 1.5: D4.A R17.2
N$15
  Top 1.016: U$17.2 131,95
  Top 1.5: D3.A R13.1 130.95,109.22 130.07,108.35 129.35,108.35 128,107 128,98 131,95
N$16
  Bottom 1.5: R7.2 149.65,112.3 U$18.1
N$17
  Top 1.5: U$19.1 148.95,100.24 R9.2
N$18
  Top 2.54: 1A_500V_FUSE_IMD_VSENSE.P$2 206.25,143.25 204.1,141.1 X5.7
N$20
  Top 1: R16.2 147.38,133.2 U$22.2
N$21
  Top 1.27: U$22.3 147.06,138 153.78,138 D5.A
N$22
  Top 1: OK3.1 146.26,128.8 R16.1
PRECHARGE+  (8 unrouted)
  Top 1.27: U$9.A10 U$9.A2 94.18,167.31 U$9.A1 U$9.A9 102.18,167.31 U$9.A10 | U$9.A10 U$9.A12 | U$9.A12 U$9.A14 U$9.A16 U$9.A18 | U$9.A18 111.18,167.31 111.18,166.52 111.08,166.41 | U$9.A17 U$9.A15 107.58,166.31 107.38,166.51 107.38,167.11 U$9.A12 | U$9.A18 115.69,168.31 126,158 126,112 122,108 122,57 119,54 88,54 71,37 71,23 71,20 71,16.46 71.34,16.13 71.34,7.87 71,7.54 71,6 70,5 44.35,5 X1.14
RST1IN  (1 unrouted)
RST2IN  (1 unrouted)
SAFETY+  (13 unrouted)
  Bottom 2.54: X1.1 35.9,30.31
SAFETY-  (8 unrouted)
  Top 1.27: X1.13 42.15,3 204,3
  Top 1.5: 208.23,7.23 204,3
TSAL_GRN_GND
  Top 1.016: R5.1 138.26,83.69 140.08,83.69 140.96,82.81 140.96,82.39 U$16.2
  Top 1.27: X1.10 73.7,35.7 89,51 149,51 154,56 154,72 149,77 144,77 142,79 U$16.2
  Bottom 1.5: U$16.2 141.2,80.55 141.2,79.79 139.46,78.05 R6.2
TSAL_RED_GND
  Top 1.27: X1.12 82.1,35.1 92,45 154,45 161,52 161,101 154,108 U$18.2
V+
  Bottom 2.54: HV+_FUSE_DRY.P$2 196.95,133 X5.1 X5.5
V-
  Top 1.27: OK3.2 U$22.1 140,136.02 140,144 141.25,145.25 180,145.25 1A_500V_FUSE_ENERGYMETER.P$1
  Top 2.54: X5.8 X5.4 196,145.3 | 196,145.3 194.05,145.3 192,143.25 1A_500V_FUSE_ENERGYMETER.P$1 | 196,145.3 196,156.75 1A_500V_FUSE_IMD_VSENSE.P$1
(copper drawn outside any net)
  shapes: Top area x2

### Text on the board
_tsilk: Discharge | Precharge | Main / Fuse | AIR+ | DCDC | AIR-